# Altium project Telemetry_Board.PrjPcb
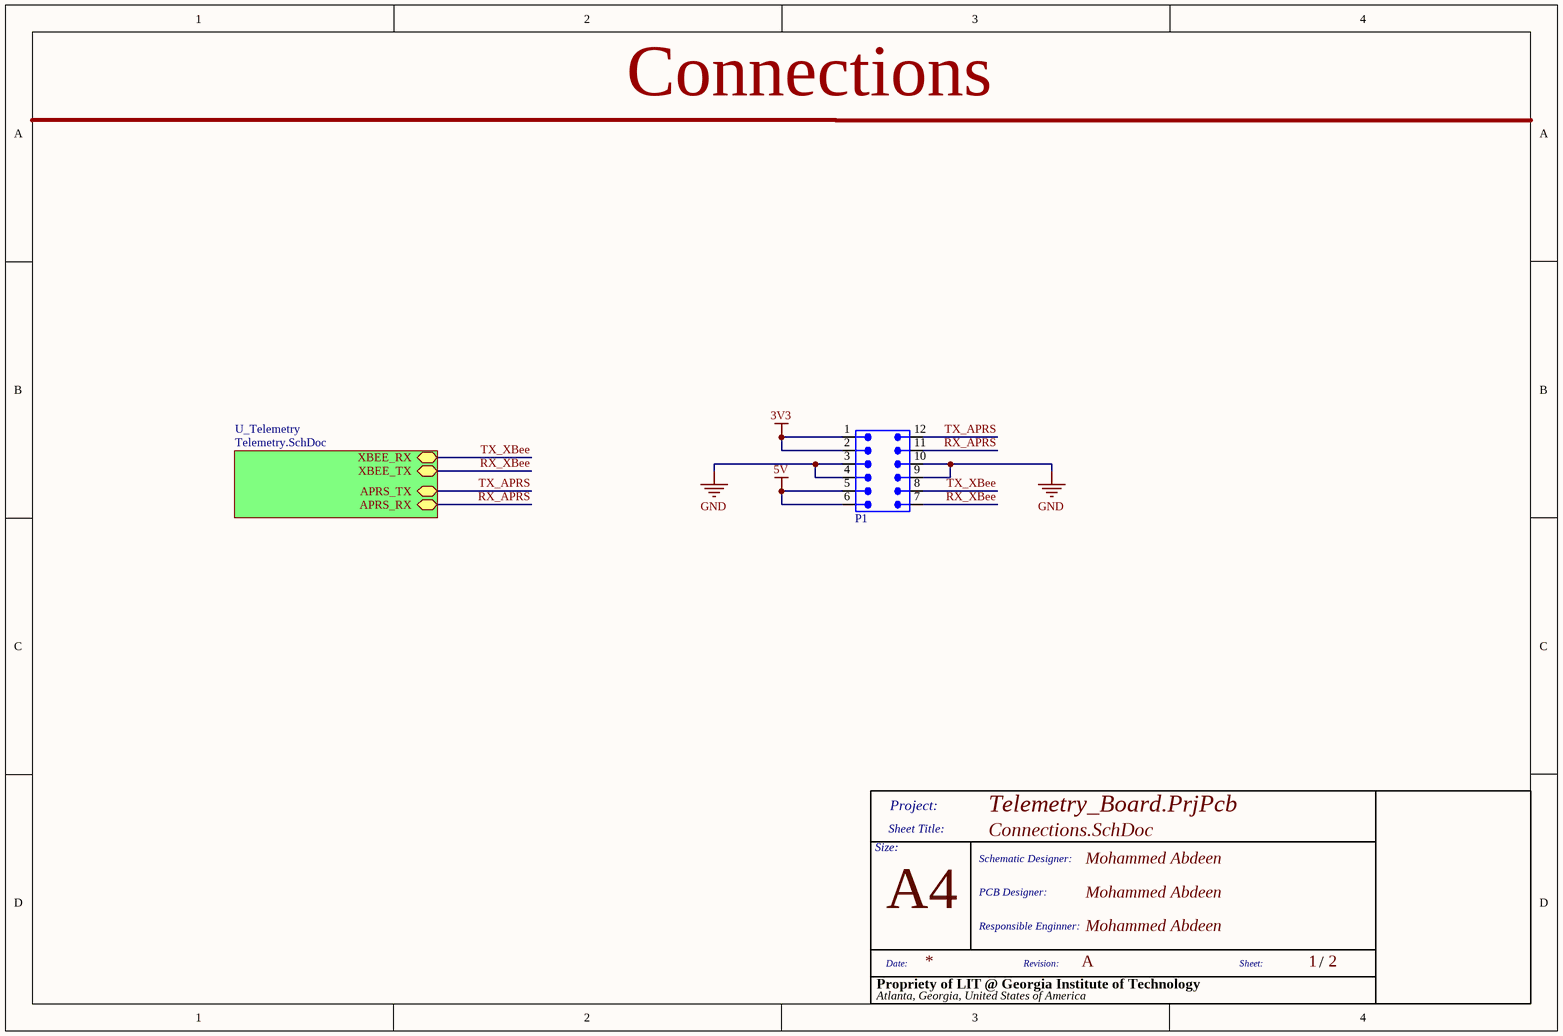
[diagram p0: Connections.SchDoc]
PCB_Engineer: Mohammed Abdeen; RE: Mohammed Abdeen; SCH_Engineer: Mohammed Abdeen; VersionRevision: A
2 sheets, 13 parts. Net scope: hierarchical (ports join the sheet entries above them; power ports are global).
Board file: TelemetryBoard.PcbDoc
Sheets:
  Connections.SchDoc
    U_Telemetry = Telemetry.SchDoc

## Sheet Connections.SchDoc
size A4; SheetNumber: 1; SheetTotal: 2

### Parts
(Parts that share a designator on the sheet are numbered #1, #2 ... from top to bottom, then left to right.)
*#1  Size: A4  (hidden comment: TitleBlock)  (graphical)
P1  HTST-106-01-L-DV-P-TR  [HTST-106-01-L-DV-P-TR]  (value not drawn)

### Sub-sheets
U_Telemetry = Telemetry.SchDoc: XBEE_RX (bidir), XBEE_TX (bidir), APRS_TX (bidir), APRS_RX (bidir)

### Nets
3V3: P1.1 P1.2
5V: P1.5 P1.6
GND: P1.3 P1.4 P1.9 P1.10
RX_APRS: P1.11 ; sheet U_Telemetry/APRS_RX  [project net APRS_RX]
RX_XBee: P1.7 ; sheet U_Telemetry/XBEE_TX
TX_APRS: P1.12 ; sheet U_Telemetry/APRS_TX  [project net APRS_TX]
TX_XBee: P1.8 ; sheet U_Telemetry/XBEE_RX

### Notes on the sheet
- Connections
- (in symbol TitleBlock) Project:; Sheet Title:; Size:; Schematic Designer:; PCB Designer:; Responsible Enginner:; Date:; Revision:; Sheet:; /; Propriety of LIT @ Georgia Institute of Technology; Atlanta, Georgia, United States of America

### Library data of the parts
*#1 = TitleBlock: Standard Title Block
P1 = BoardToBoard_Bottom: Connector Header Through Hole 12 position 0.100" (2.54mm)

## Sheet Telemetry.SchDoc
size A4; SheetNumber: 2; SheetTotal: 2
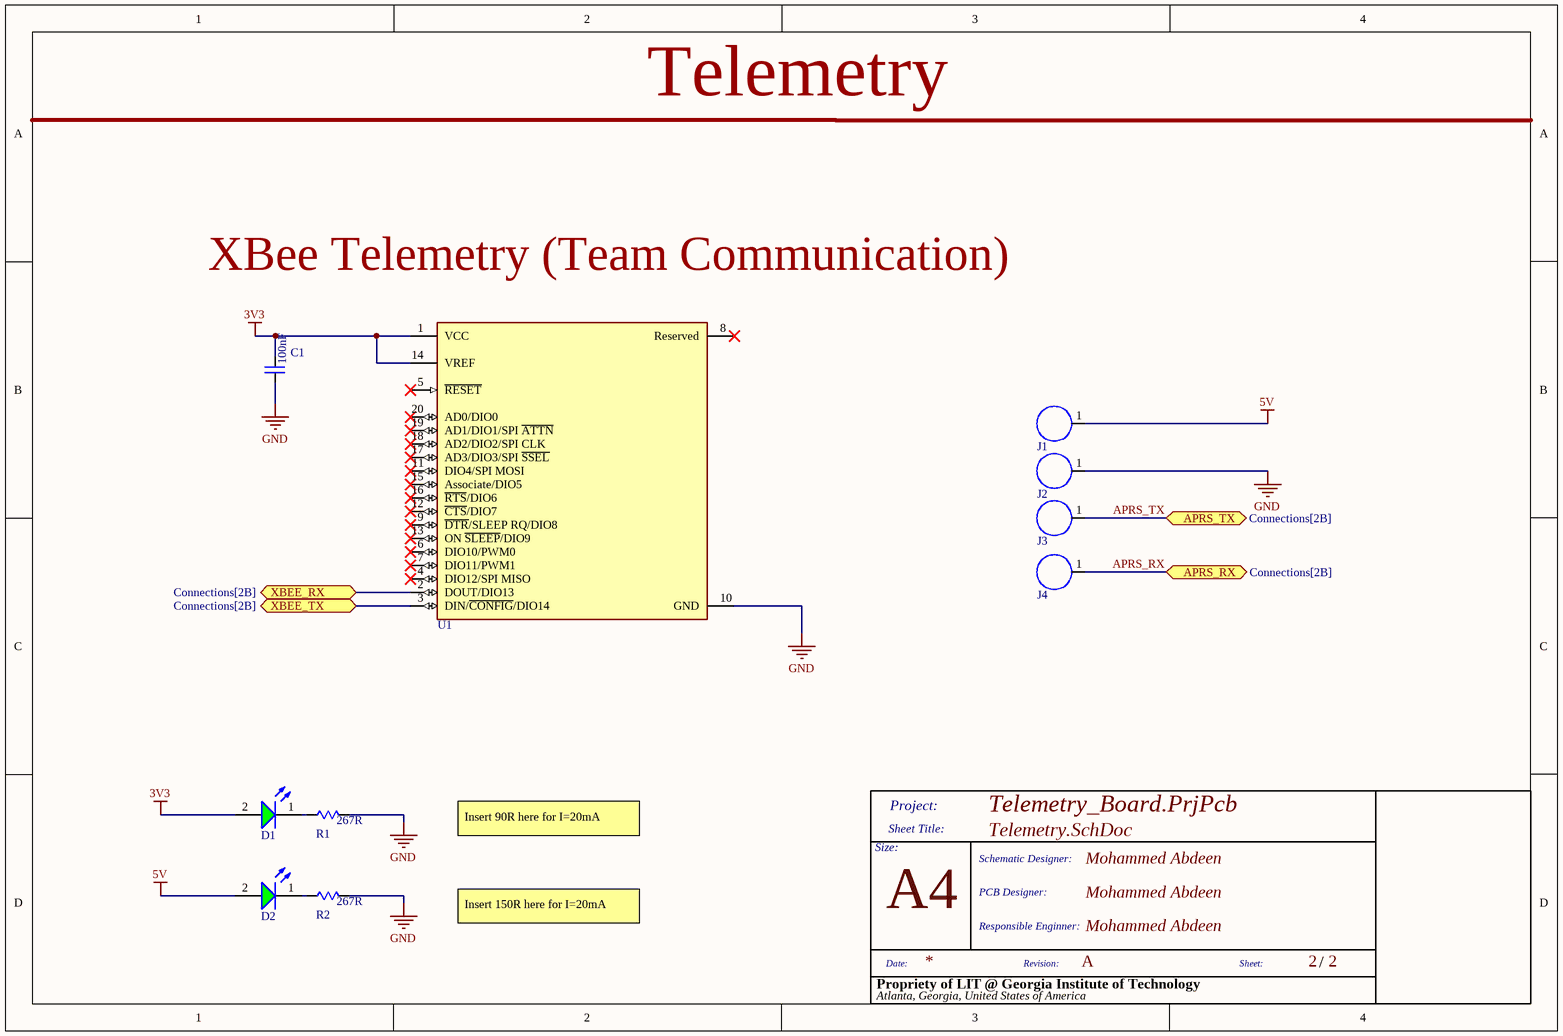
[diagram p1: Telemetry.SchDoc]

### Parts
(Parts that share a designator on the sheet are numbered #1, #2 ... from top to bottom, then left to right.)
*#2  Size: A4  (hidden comment: TitleBlock)  (graphical)
C1  AGC0603X7R500-104KNP  [0603-CAP]  (value not drawn)
D1  LTST-C190KGKT  [FP-LTST-C190KGKT-MFG]  (value not drawn)
D2  LTST-C190KGKT  [FP-LTST-C190KGKT-MFG]  (value not drawn)
J1  Solder Pad  [Solder_Pad]  (value not drawn)
J2  Solder Pad  [Solder_Pad]  (value not drawn)
J3  Solder Pad  [Solder_Pad]  (value not drawn)
J4  Solder Pad  [Solder_Pad]  (value not drawn)
R1  ERJ-3EKF2670V  [0603-RES]  (value not drawn)
R2  ERJ-3EKF2670V  [0603-RES]  (value not drawn)
U1  XBP9B-XCST-001  [XBee]  (value not drawn)

### Ports
APRS_RX (bidir, see Connections[2B]), APRS_TX (bidir, see Connections[2B]), XBEE_RX (bidir, see Connections[2B]), XBEE_TX (bidir, see Connections[2B])

### Nets
3V3: C1.2 D1.2(A) U1.1(VCC) U1.14(VREF)
5V: D2.2(A) J1.1
GND: C1.1 J2.1 R1.2 R2.2 U1.10(GND)
APRS_RX: J4.1 ; port APRS_RX
APRS_TX: J3.1 ; port APRS_TX
RX_XBee: U1.3(DIN/~{CONFIG}/DIO14) ; port XBEE_TX
TX_XBee: U1.2(DOUT/DIO13) ; port XBEE_RX
NetD1_1: D1.1(K) R1.1
NetD2_1: D2.1(K) R2.1

Not connected (* = marked no-connect by the designer): U1 4(DIO12/SPI_MISO)* 5(~{RESET})* 6(DIO10/PWM0)* 7(DIO11/PWM1)* 8(Reserved)* 9(~{DTR}/SLEEP_RQ/DIO8)* 11(DIO4/SPI_MOSI)* 12(~{CTS}/DIO7)* 13(ON_~{SLEEP}/DIO9)* 15(Associate/DIO5)* 16(~{RTS}/DIO6)* 17(AD3/DIO3/SPI_~{SSEL})* 18(AD2/DIO2/SPI_CLK)* 19(AD1/DIO1/SPI_~{ATTN})* 20(AD0/DIO0)*

### Notes on the sheet
- Telemetry
- XBee Telemetry (Team Communication)
- Insert 90R here for I=20mA
- Insert 150R here for I=20mA
- (in symbol AGC0603X7R500-104KNP) 100nF
- (in symbol RES-0603-267R) 267R
- (in symbol TitleBlock) Project:; Sheet Title:; Size:; Schematic Designer:; PCB Designer:; Responsible Enginner:; Date:; Revision:; Sheet:; /; Propriety of LIT @ Georgia Institute of Technology; Atlanta, Georgia, United States of America

### Library data of the parts
*#2 = TitleBlock: Standard Title Block
C1 = AGC0603X7R500-104KNP: 100nF ±10% 50V Ceramic Capacitor X7R 0603 (1608 Metric); Manufacturer: Venkel; Part number: AGC0603X7R500-104KNP
D1 D2 = LED-0603-Green_: Green 571nm LED Indication - Discrete 2V 0603 (1608 Metric)
J1-J4 = Solder_Pad: Use for external and high current connections (cheaper than castellated holes)
R1 R2 = RES-0603-267R: 267 Ohms ±1% 0.1W, 1/10W Chip Resistor 0603 (1608 Metric) Automotive AEC-Q200 Thick Film; Manufacturer: Panasonic Electronic Components; Part number: ERJ-3EKF2670V
U1 = XBee: General ISM < 1GHz Transceiver Module 900MHz Antenna Not Included, RP-SMA Through Hole

## Nets that join several sheets
3V3: Connections (P1.1 P1.2), Telemetry (C1.2 D1.2 U1.1 U1.14)
5V: Connections (P1.5 P1.6), Telemetry (D2.2 J1.1)
GND: Connections (P1.3 P1.4 P1.9 P1.10), Telemetry (5 pins)
APRS_RX: Connections (P1.11), Telemetry (J4.1)
APRS_TX: Connections (P1.12), Telemetry (J3.1)
RX_XBee: Connections (P1.7), Telemetry (U1.3)
TX_XBee: Connections (P1.8), Telemetry (U1.2)